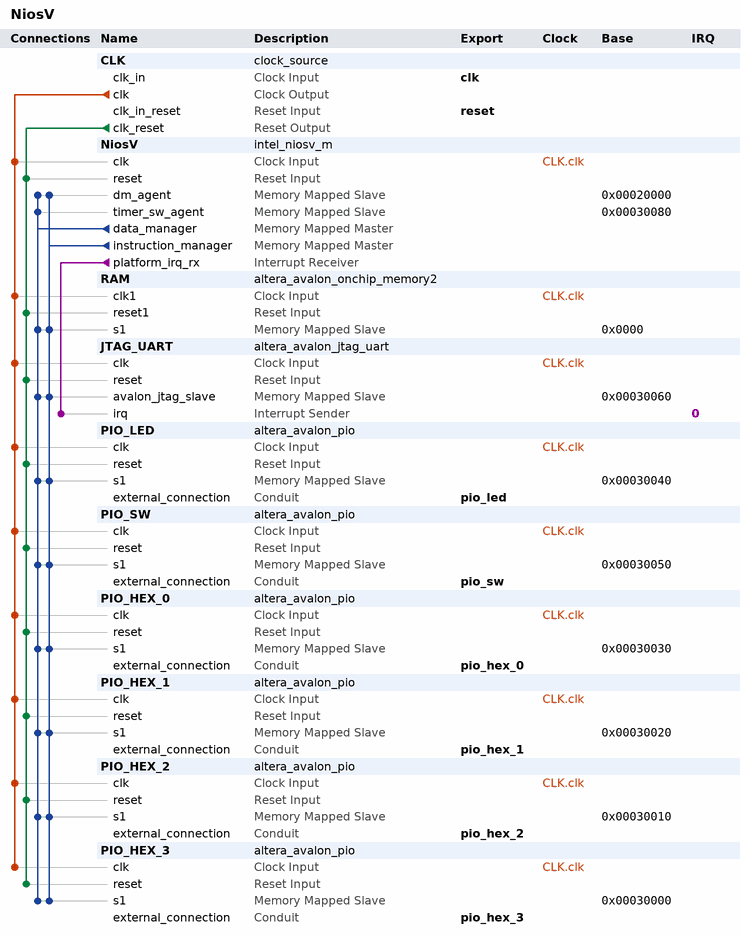
[diagram p0: system contents]
# Platform Designer (Qsys) system NiosV, Cyclone V 5CSXFC6D6F31C6
# Parameters at their usual value, and those the tool derives, are not listed.
package require -exact qsys 24.1
create_system NiosV
set_project_property DEVICE_FAMILY {Cyclone V}
set_project_property DEVICE 5CSXFC6D6F31C6

add_instance CLK clock_source 24.1
set_instance_parameter_value CLK clockFrequency 50000000

add_instance NiosV intel_niosv_m 26.0.0
set_instance_parameter_value NiosV enableAvalonInterface false
set_instance_parameter_value NiosV enableDebugReset false
set_instance_parameter_value NiosV enableECCLite false
set_instance_parameter_value NiosV hartId 0
set_instance_parameter_value NiosV interruptMode 0
set_instance_parameter_value NiosV pipelineArch true
set_instance_parameter_value NiosV resetSlave Absolute

add_instance RAM altera_avalon_onchip_memory2 24.1
set_instance_parameter_value RAM dataWidth 32
set_instance_parameter_value RAM dualPort false
set_instance_parameter_value RAM initMemContent true
set_instance_parameter_value RAM initializationFileName onchip_mem.hex
set_instance_parameter_value RAM memorySize 122880

add_instance JTAG_UART altera_avalon_jtag_uart 24.1
set_instance_parameter_value JTAG_UART simInteractiveOptions NO_INTERACTIVE_WINDOWS

add_instance PIO_LED altera_avalon_pio 24.1
set_instance_parameter_value PIO_LED direction Output
set_instance_parameter_value PIO_LED width 8

add_instance PIO_SW altera_avalon_pio 24.1
set_instance_parameter_value PIO_SW direction Input
set_instance_parameter_value PIO_SW width 8

add_instance PIO_HEX_0 altera_avalon_pio 24.1
set_instance_parameter_value PIO_HEX_0 direction Output
set_instance_parameter_value PIO_HEX_0 width 8

add_instance PIO_HEX_1 altera_avalon_pio 24.1
set_instance_parameter_value PIO_HEX_1 direction Output
set_instance_parameter_value PIO_HEX_1 width 8

add_instance PIO_HEX_2 altera_avalon_pio 24.1
set_instance_parameter_value PIO_HEX_2 direction Output
set_instance_parameter_value PIO_HEX_2 width 8

add_instance PIO_HEX_3 altera_avalon_pio 24.1
set_instance_parameter_value PIO_HEX_3 direction Output
set_instance_parameter_value PIO_HEX_3 width 8

# connections
add_connection CLK.clk JTAG_UART.clk clock
add_connection CLK.clk NiosV.clk clock
add_connection CLK.clk PIO_HEX_0.clk clock
add_connection CLK.clk PIO_HEX_1.clk clock
add_connection CLK.clk PIO_HEX_2.clk clock
add_connection CLK.clk PIO_HEX_3.clk clock
add_connection CLK.clk PIO_LED.clk clock
add_connection CLK.clk PIO_SW.clk clock
add_connection CLK.clk RAM.clk1 clock
add_connection CLK.clk_reset JTAG_UART.reset reset
add_connection CLK.clk_reset NiosV.reset reset
add_connection CLK.clk_reset PIO_HEX_0.reset reset
add_connection CLK.clk_reset PIO_HEX_1.reset reset
add_connection CLK.clk_reset PIO_HEX_2.reset reset
add_connection CLK.clk_reset PIO_HEX_3.reset reset
add_connection CLK.clk_reset PIO_LED.reset reset
add_connection CLK.clk_reset PIO_SW.reset reset
add_connection CLK.clk_reset RAM.reset1 reset
add_connection NiosV.data_manager JTAG_UART.avalon_jtag_slave avalon
set_connection_parameter_value NiosV.data_manager/JTAG_UART.avalon_jtag_slave baseAddress 0x00030060
add_connection NiosV.data_manager NiosV.dm_agent avalon
set_connection_parameter_value NiosV.data_manager/NiosV.dm_agent baseAddress 0x00020000
add_connection NiosV.data_manager NiosV.timer_sw_agent avalon
set_connection_parameter_value NiosV.data_manager/NiosV.timer_sw_agent baseAddress 0x00030080
add_connection NiosV.data_manager PIO_HEX_0.s1 avalon
set_connection_parameter_value NiosV.data_manager/PIO_HEX_0.s1 baseAddress 0x00030030
add_connection NiosV.data_manager PIO_HEX_1.s1 avalon
set_connection_parameter_value NiosV.data_manager/PIO_HEX_1.s1 baseAddress 0x00030020
add_connection NiosV.data_manager PIO_HEX_2.s1 avalon
set_connection_parameter_value NiosV.data_manager/PIO_HEX_2.s1 baseAddress 0x00030010
add_connection NiosV.data_manager PIO_HEX_3.s1 avalon
set_connection_parameter_value NiosV.data_manager/PIO_HEX_3.s1 baseAddress 0x00030000
add_connection NiosV.data_manager PIO_LED.s1 avalon
set_connection_parameter_value NiosV.data_manager/PIO_LED.s1 baseAddress 0x00030040
add_connection NiosV.data_manager PIO_SW.s1 avalon
set_connection_parameter_value NiosV.data_manager/PIO_SW.s1 baseAddress 0x00030050
add_connection NiosV.data_manager RAM.s1 avalon
set_connection_parameter_value NiosV.data_manager/RAM.s1 baseAddress 0x0000
add_connection NiosV.instruction_manager JTAG_UART.avalon_jtag_slave avalon
set_connection_parameter_value NiosV.instruction_manager/JTAG_UART.avalon_jtag_slave baseAddress 0x00030060
add_connection NiosV.instruction_manager NiosV.dm_agent avalon
set_connection_parameter_value NiosV.instruction_manager/NiosV.dm_agent baseAddress 0x00020000
add_connection NiosV.instruction_manager PIO_HEX_0.s1 avalon
set_connection_parameter_value NiosV.instruction_manager/PIO_HEX_0.s1 baseAddress 0x00030030
add_connection NiosV.instruction_manager PIO_HEX_1.s1 avalon
set_connection_parameter_value NiosV.instruction_manager/PIO_HEX_1.s1 baseAddress 0x00030020
add_connection NiosV.instruction_manager PIO_HEX_2.s1 avalon
set_connection_parameter_value NiosV.instruction_manager/PIO_HEX_2.s1 baseAddress 0x00030010
add_connection NiosV.instruction_manager PIO_HEX_3.s1 avalon
set_connection_parameter_value NiosV.instruction_manager/PIO_HEX_3.s1 baseAddress 0x00030000
add_connection NiosV.instruction_manager PIO_LED.s1 avalon
set_connection_parameter_value NiosV.instruction_manager/PIO_LED.s1 baseAddress 0x00030040
add_connection NiosV.instruction_manager PIO_SW.s1 avalon
set_connection_parameter_value NiosV.instruction_manager/PIO_SW.s1 baseAddress 0x00030050
add_connection NiosV.instruction_manager RAM.s1 avalon
set_connection_parameter_value NiosV.instruction_manager/RAM.s1 baseAddress 0x0000
add_connection NiosV.platform_irq_rx JTAG_UART.irq interrupt
set_connection_parameter_value NiosV.platform_irq_rx/JTAG_UART.irq irqNumber 0

# exported interfaces
add_interface clk clock sink
set_interface_property clk EXPORT_OF CLK.clk_in
add_interface pio_hex_0 conduit end
set_interface_property pio_hex_0 EXPORT_OF PIO_HEX_0.external_connection
add_interface pio_hex_1 conduit end
set_interface_property pio_hex_1 EXPORT_OF PIO_HEX_1.external_connection
add_interface pio_hex_2 conduit end
set_interface_property pio_hex_2 EXPORT_OF PIO_HEX_2.external_connection
add_interface pio_hex_3 conduit end
set_interface_property pio_hex_3 EXPORT_OF PIO_HEX_3.external_connection
add_interface pio_led conduit end
set_interface_property pio_led EXPORT_OF PIO_LED.external_connection
add_interface pio_sw conduit end
set_interface_property pio_sw EXPORT_OF PIO_SW.external_connection
add_interface reset reset sink
set_interface_property reset EXPORT_OF CLK.clk_in_reset

set_interconnect_requirement {$system} qsys_mm.clockCrossingAdapter HANDSHAKE
set_interconnect_requirement {$system} qsys_mm.enableEccProtection FALSE
set_interconnect_requirement {$system} qsys_mm.insertDefaultSlave FALSE
set_interconnect_requirement {$system} qsys_mm.maxAdditionalLatency 1

save_system NiosV.qsys
